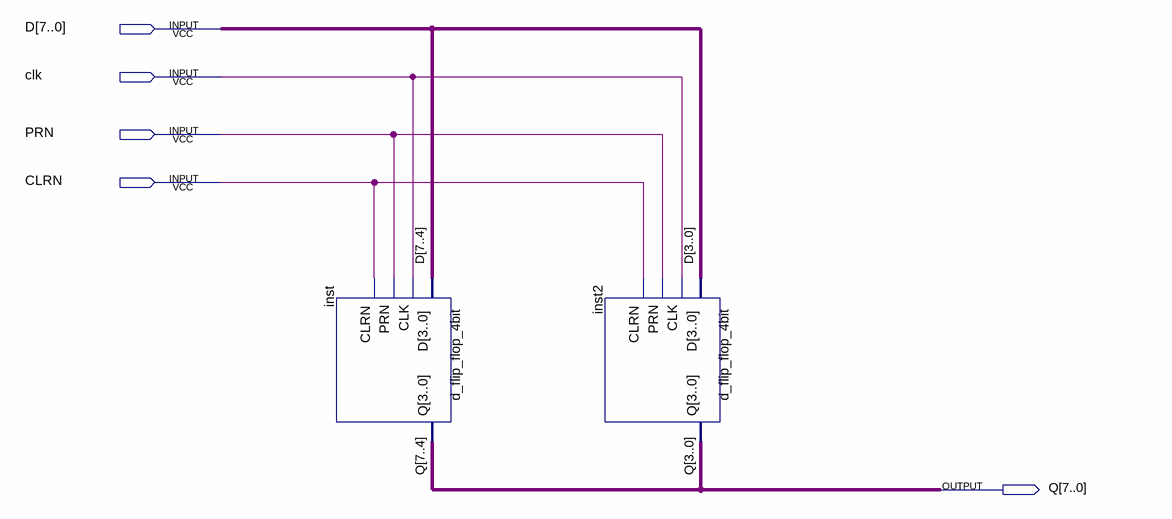
[diagram p0: schematic sheet]
// Quartus schematic d_flip_flop_8bit.bdf as structural Verilog: 2 symbols, 5 pins
module d_flip_flop_8bit (
  input  [7:0] D,
  input  clk,
  input  PRN,
  input  CLRN,
  output [7:0] Q
);

  d_flip_flop_4bit inst (.D(D[7:4]), .CLK(clk), .PRN(PRN), .CLRN(CLRN), .Q(Q[7:4]));
  d_flip_flop_4bit inst2 (.D(D[3:0]), .CLK(clk), .PRN(PRN), .CLRN(CLRN), .Q(Q[3:0]));
endmodule
